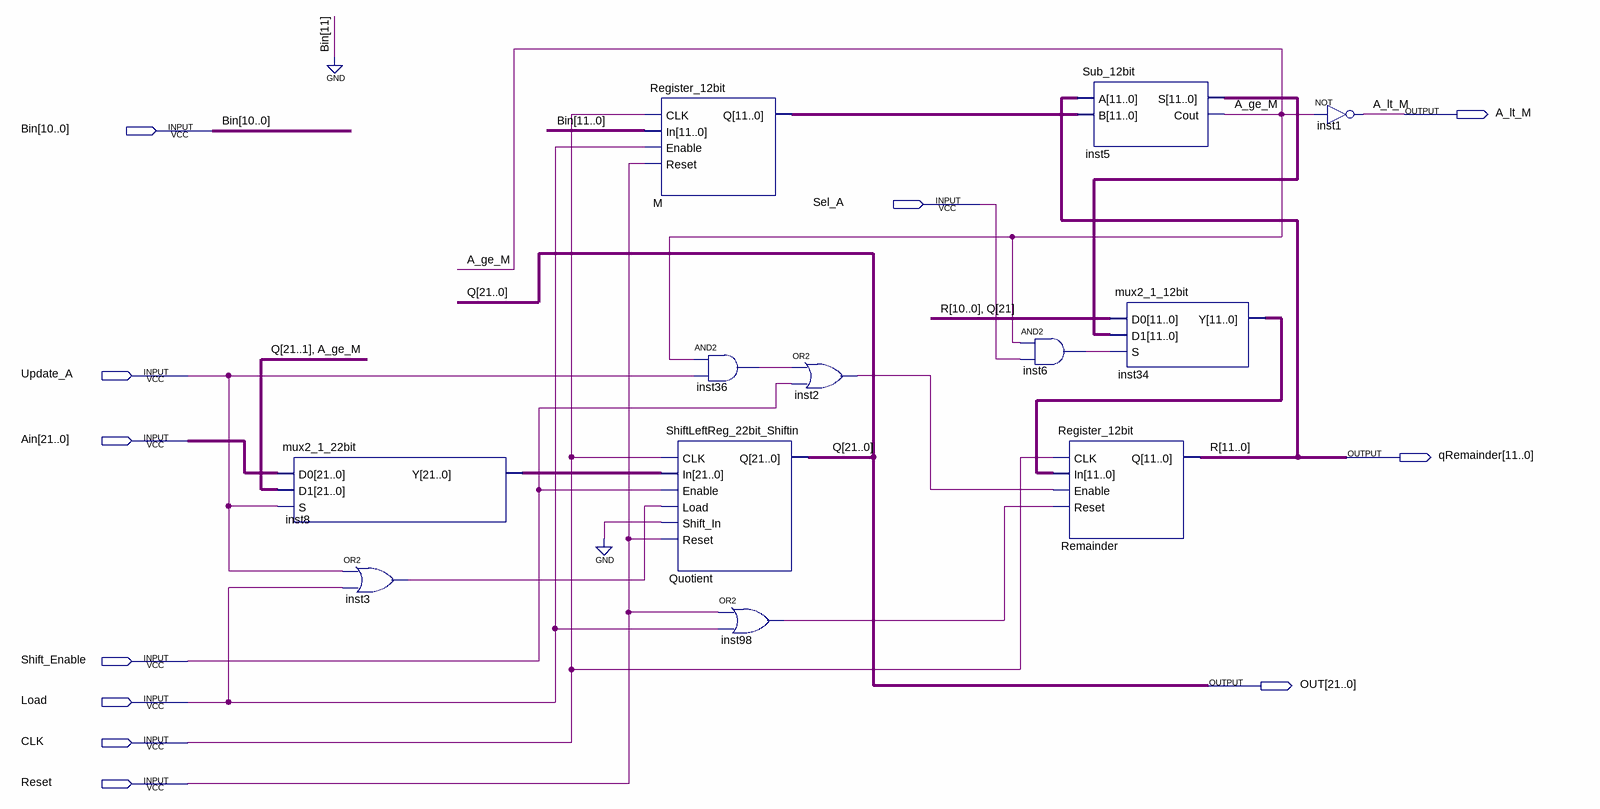
[diagram p0: schematic sheet]
// Quartus schematic Datapath_Div.bdf as structural Verilog: 12 symbols, 11 pins
module Datapath_Div (
  input  [10:0] Bin,
  input  Sel_A,
  input  Update_A,
  input  [21:0] Ain,
  input  Shift_Enable,
  input  Load,
  input  CLK,
  input  Reset,
  output A_lt_M,
  output [11:0] qRemainder,
  output [21:0] OUT
);

  wire A_ge_M, inst2_out, inst3_out, inst6_out, inst36_out, inst98_out;
  wire [11:0] inst5_s, inst34_y, M_q;
  wire [21:0] inst8_y;

  mux2_1_22bit inst8 (.D0(Ain), .D1({OUT[21:1], A_ge_M}), .S(Update_A), .Y(inst8_y));
  or inst3 (inst3_out, Update_A, Load);
  Register_12bit M (.CLK(CLK), .In({1'b0, Bin}), .Enable(Load), .Reset(Reset), .Q(M_q));
  and inst36 (inst36_out, A_ge_M, Update_A);
  ShiftLeftReg_22bit_Shiftin Quotient (
    .CLK(CLK), .In(inst8_y), .Enable(Shift_Enable), .Load(inst3_out), .Shift_In(1'b0), .Reset(Reset), .Q(OUT));
  or inst98 (inst98_out, Reset, Load);
  or inst2 (inst2_out, inst36_out, Shift_Enable);
  and inst6 (inst6_out, A_ge_M, Sel_A);
  Sub_12bit inst5 (.A(qRemainder), .B(M_q), .S(inst5_s), .Cout(A_ge_M));
  mux2_1_12bit inst34 (.D0({qRemainder[10:0], OUT[21]}), .D1(inst5_s), .S(inst6_out), .Y(inst34_y));
  Register_12bit Remainder (.CLK(CLK), .In(inst34_y), .Enable(inst2_out), .Reset(inst98_out), .Q(qRemainder));
  not inst1 (A_lt_M, A_ge_M);

  // Other names for the same wires on the sheet: Q[21:0] = OUT; R[11:0] = qRemainder
endmodule
